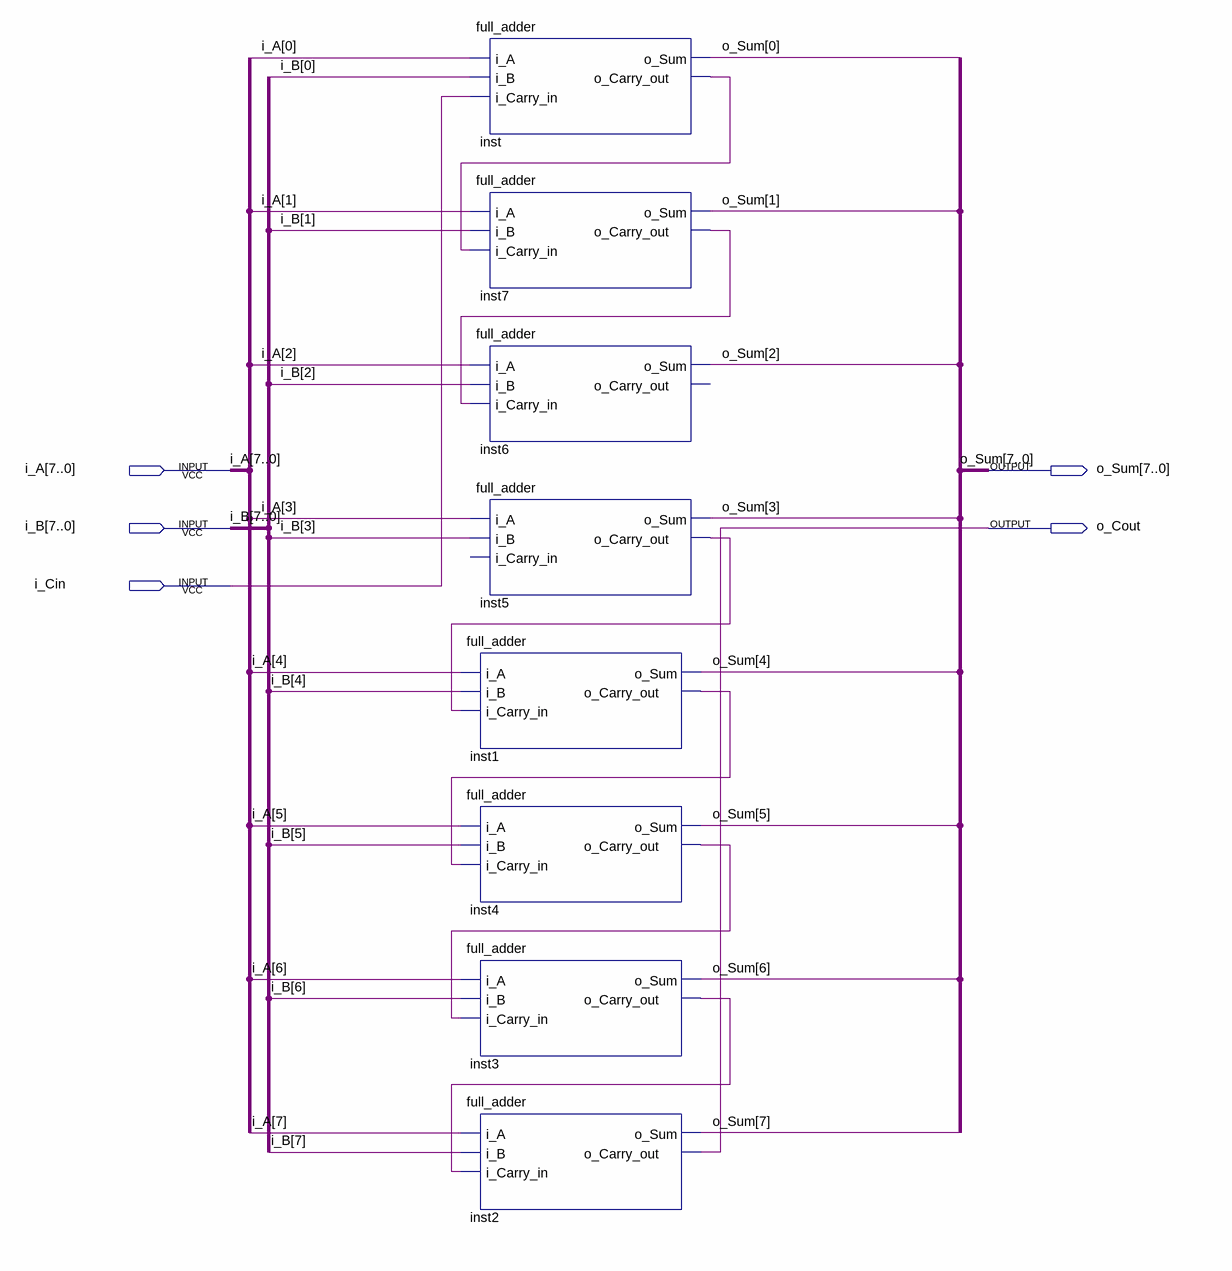
[diagram p0: schematic sheet]
// Quartus schematic full_adder_8_bit.bdf as structural Verilog: 8 symbols, 5 pins
module full_adder_8_bit (
  input  [7:0] i_A,
  input  [7:0] i_B,
  input  i_Cin,
  output [7:0] o_Sum,
  output o_Cout
);

  wire inst1_o_carry_out, inst3_o_carry_out, inst4_o_carry_out, inst5_o_carry_out, inst7_o_carry_out,
       inst_o_carry_out;

  full_adder inst (.i_A(i_A[0]), .i_B(i_B[0]), .i_Carry_in(i_Cin), .o_Sum(o_Sum[0]), .o_Carry_out(inst_o_carry_out));
  full_adder inst7 (
    .i_A(i_A[1]), .i_B(i_B[1]), .i_Carry_in(inst_o_carry_out), .o_Sum(o_Sum[1]),
    .o_Carry_out(inst7_o_carry_out));
  full_adder inst6 (.i_A(i_A[2]), .i_B(i_B[2]), .i_Carry_in(inst7_o_carry_out), .o_Sum(o_Sum[2]));  // open: o_Carry_out
  full_adder inst5 (.i_A(i_A[3]), .i_B(i_B[3]), .o_Sum(o_Sum[3]), .o_Carry_out(inst5_o_carry_out));  // open: i_Carry_in
  full_adder inst1 (
    .i_A(i_A[4]), .i_B(i_B[4]), .i_Carry_in(inst5_o_carry_out), .o_Sum(o_Sum[4]),
    .o_Carry_out(inst1_o_carry_out));
  full_adder inst4 (
    .i_A(i_A[5]), .i_B(i_B[5]), .i_Carry_in(inst1_o_carry_out), .o_Sum(o_Sum[5]),
    .o_Carry_out(inst4_o_carry_out));
  full_adder inst3 (
    .i_A(i_A[6]), .i_B(i_B[6]), .i_Carry_in(inst4_o_carry_out), .o_Sum(o_Sum[6]),
    .o_Carry_out(inst3_o_carry_out));
  full_adder inst2 (.i_A(i_A[7]), .i_B(i_B[7]), .i_Carry_in(inst3_o_carry_out), .o_Sum(o_Sum[7]), .o_Carry_out(o_Cout));
endmodule
